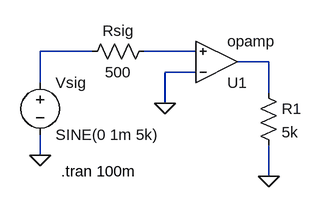
[diagram p0: schematic Draft1.asc]
Draft1.asc, the LTspice schematic file:
Version 4
SHEET 1 880 680
WIRE 48 112 -32 112
WIRE 208 112 128 112
WIRE 320 128 272 128
WIRE 208 144 160 144
WIRE -32 160 -32 112
WIRE 320 176 320 128
WIRE 160 192 160 144
WIRE -32 272 -32 240
WIRE 320 304 320 256
FLAG 160 192 0
FLAG -32 272 0
FLAG 320 304 0
SYMBOL OpAmps\\opamp 240 192 M180
SYMATTR InstName U1
SYMBOL res 144 96 R90
WINDOW 0 0 56 VBottom 2
WINDOW 3 32 56 VTop 2
SYMATTR InstName Rsig
SYMATTR Value 500
SYMBOL voltage -32 144 R0
WINDOW 123 0 0 Left 0
WINDOW 39 0 0 Left 0
SYMATTR InstName Vsig
SYMATTR Value SINE(0 1m 5k)
SYMBOL res 304 160 R0
SYMATTR InstName R1
SYMATTR Value 5k
TEXT 0 296 Left 2 !.tran 100m

The netlist it stands for:
* Draft1.asc
XU1 0 N002 N003 opamp Aol=100K GBW=10Meg  ; pins invin noninvin out
Rsig N002 N001 500
Vsig N001 0 SINE(0 1m 5k)
R1 N003 0 5k
.tran 100m
.backanno
.end